# EAGLE design PIR AM612 (EAGLE 9.6.2)
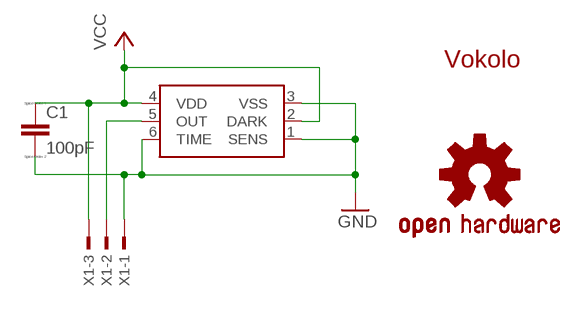
[diagram p0: schematic, sheet 1]

## Parts
C1  100pF  CC0603  [C0603]
LOGO1  OSHW-LOGOS  [OSHW-LOGO-S]
U$2  AM612  [TO5]
U$3  LOGO_VOKOLO9,7MM  [LOGO_VOKOLO_8MM]
X1  TSW-103-07-G-S  [TSW-103-XX-G-S]

## Nets
GND: C1.2 U$2.1(SENS) U$2.3(VSS) U$2.6(TIME) X1.1
N$1: U$2.5(OUT) X1.2
VCC: C1.1 U$2.2(DARK) U$2.4(VDD) X1.3

## Library data of the parts
C1 = eagle-ltspice:C: CAPACITOR, European symbol; SPICEMODEL: NONE; SPICEPREFIX: C
LOGO1 = SparkFun-Aesthetics:OSHW-LOGO: Open-Source Hardware (OSHW) Logo This logo indicates the piece of hardware it is found on incorporates a OSHW license and/or adheres to the definition of open source hardware found here: http://freedomdefined.org/OSHW
U$2 = AM612:AM612
U$3 = logo_vokolo:LOGO_VOKOLO: logo vokolo
X1 = con-samtec:TSW-103-*-G-S: THROUGH-HOLE .025" SQ POST HEADER Source: Samtec TSW.pdf; MF: Samtec Inc.; MPN: TSW-103-07-G-S

## Board
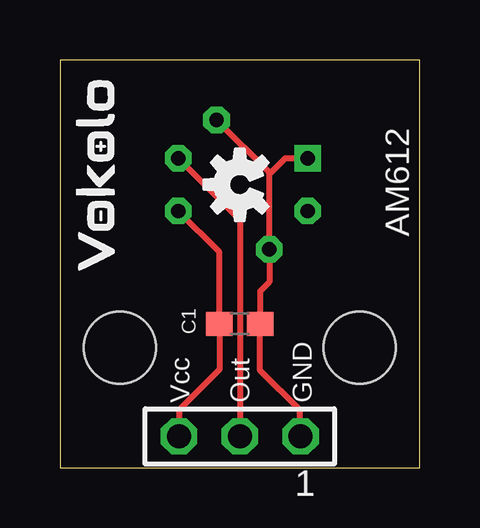
[diagram p1: board, top side]
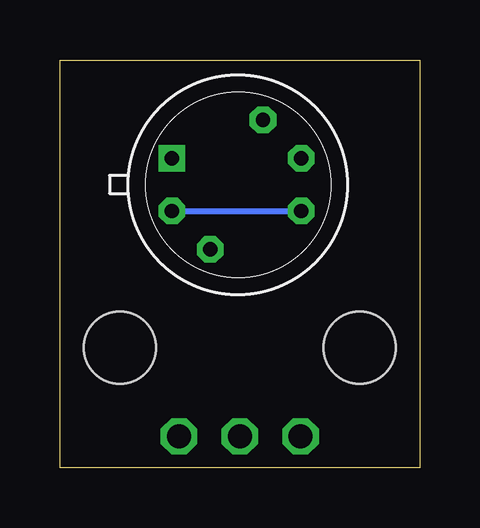
[diagram p2: board, bottom side, seen from below]

Size 15 x 17 mm. Coordinates in mm from the lower left corner, seen from the top.
Outline: 0,0 15,0 15,17 0,17 0,0
Copper layers (1*16): Top 0.035mm / dielectric 1.5mm / Bottom 0.035mm
Design rules "default": minimum track width 6mil, minimum drill 0.3mm, track to track 6mil, track to pad 6mil, pad to pad 6mil, via to via 6mil, smd to smd 6mil, copper to edge 20mil, drill to drill 6mil, minimum pad ring 10mil, minimum via ring 8mil, stop-mask expansion 4mil, vias tented up to drill 0.3mm, thermal gap 12mil
Holes 3 mm at 2.5,5 12.5,5

### Footprints (pad centres in the part's own frame; a part is rotated, then mirrored left to right if it is on the bottom)
C0603 = smd 1.1 x 1: 1 -0.85,0; 2 0.85,0
TO5 = drill 0.6 square: 1 2.83,-1.1 | drill 0.6 octagon: 2 2.83,1.1; 3 1.23,2.7; 4 -2.57,1.1; 5 -2.57,-1.1; 6 -0.97,-2.7
TSW-103-XX-G-S = drill 1 pad 1.5 octagon: 1 2.54,0; 2 0,0; 3 -2.54,0

### Placement (x,y rotation side)
C1  7.5,6 0 top
LOGO1  7.5,11.8 90 top
U$2  7.5,11.8 180 bottom
U$3  2.3,8.2 90 top
X1  7.5,1.3 0 top

### Tracks (layer width: path | path; a pad name or v marks a point on that pad's centre or on a via)
GND
  Top 0.254: X1.1 10,1.34 10,2.4 8.35,4.05 C1.2 8.35,7.35 8.73,7.73 U$2.3 8.73,12.23 | U$2.1 9.4,12.9 8.73,12.23 | U$2.6 8.73,12.3 8.73,12.23
N$1
  Top 0.254: U$2.5 7.5,10.33 X1.2
VCC
  Top 0.254: X1.3 4.96,2.4 6.65,4.09 C1.1 6.65,8.98 U$2.4
  Bottom 0.254: U$2.2 U$2.4

### Text on the board
tNames: Vcc | Out | GND